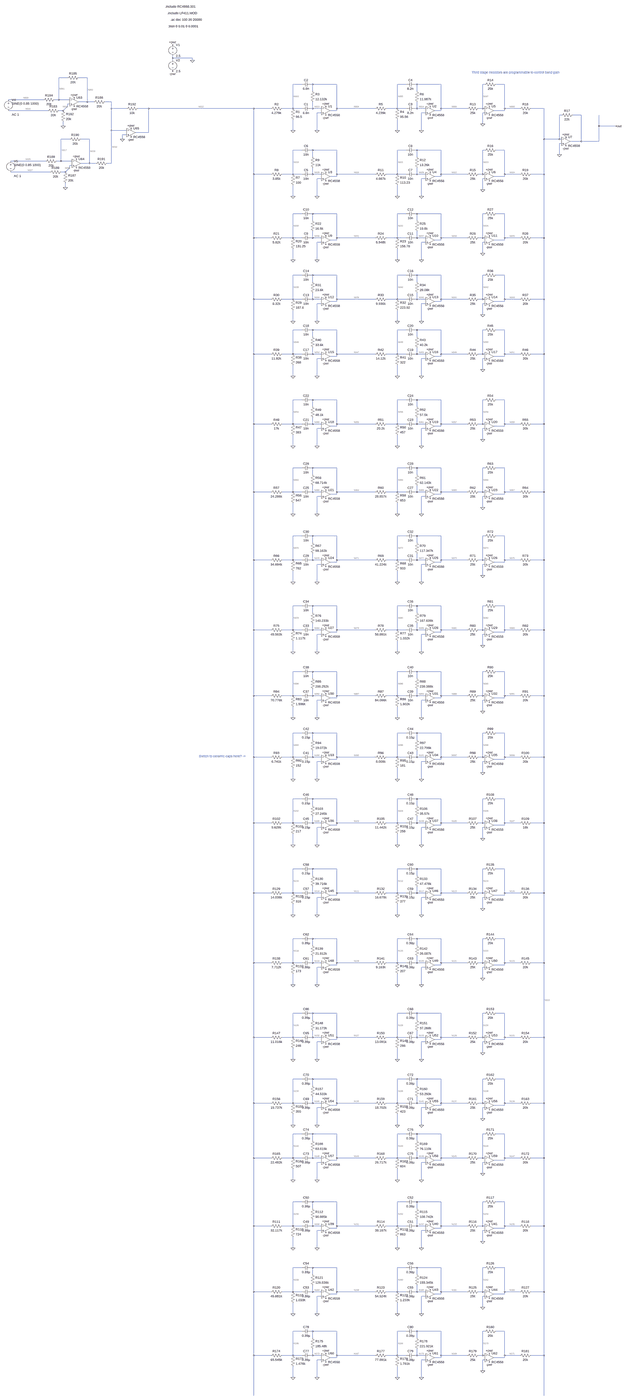
[diagram p0: schematic Equalizer.asc, whole sheet]
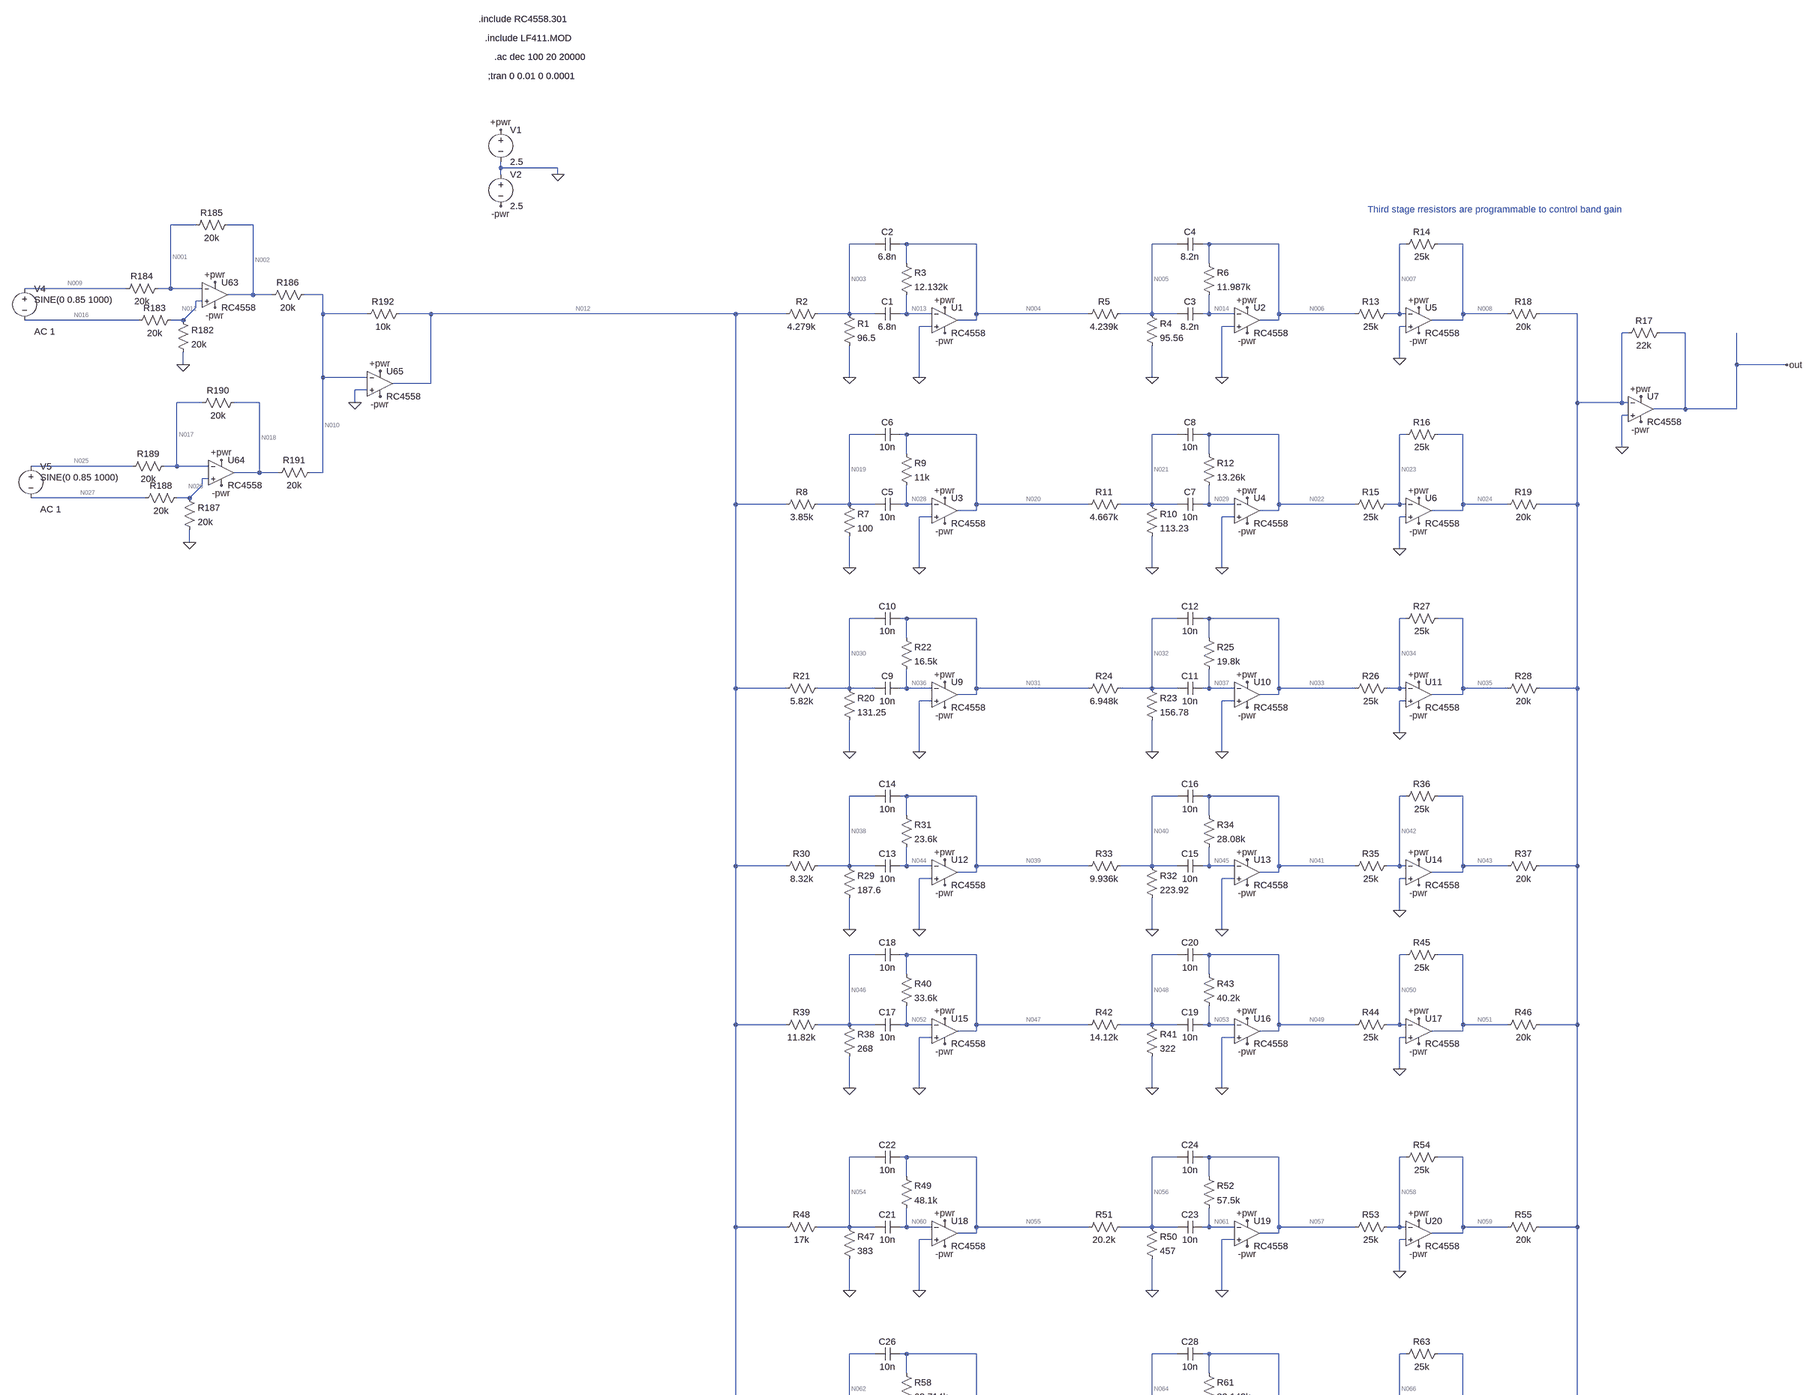
[diagram p1: schematic Equalizer.asc, part, row 1 of 3, column 1 of 1]
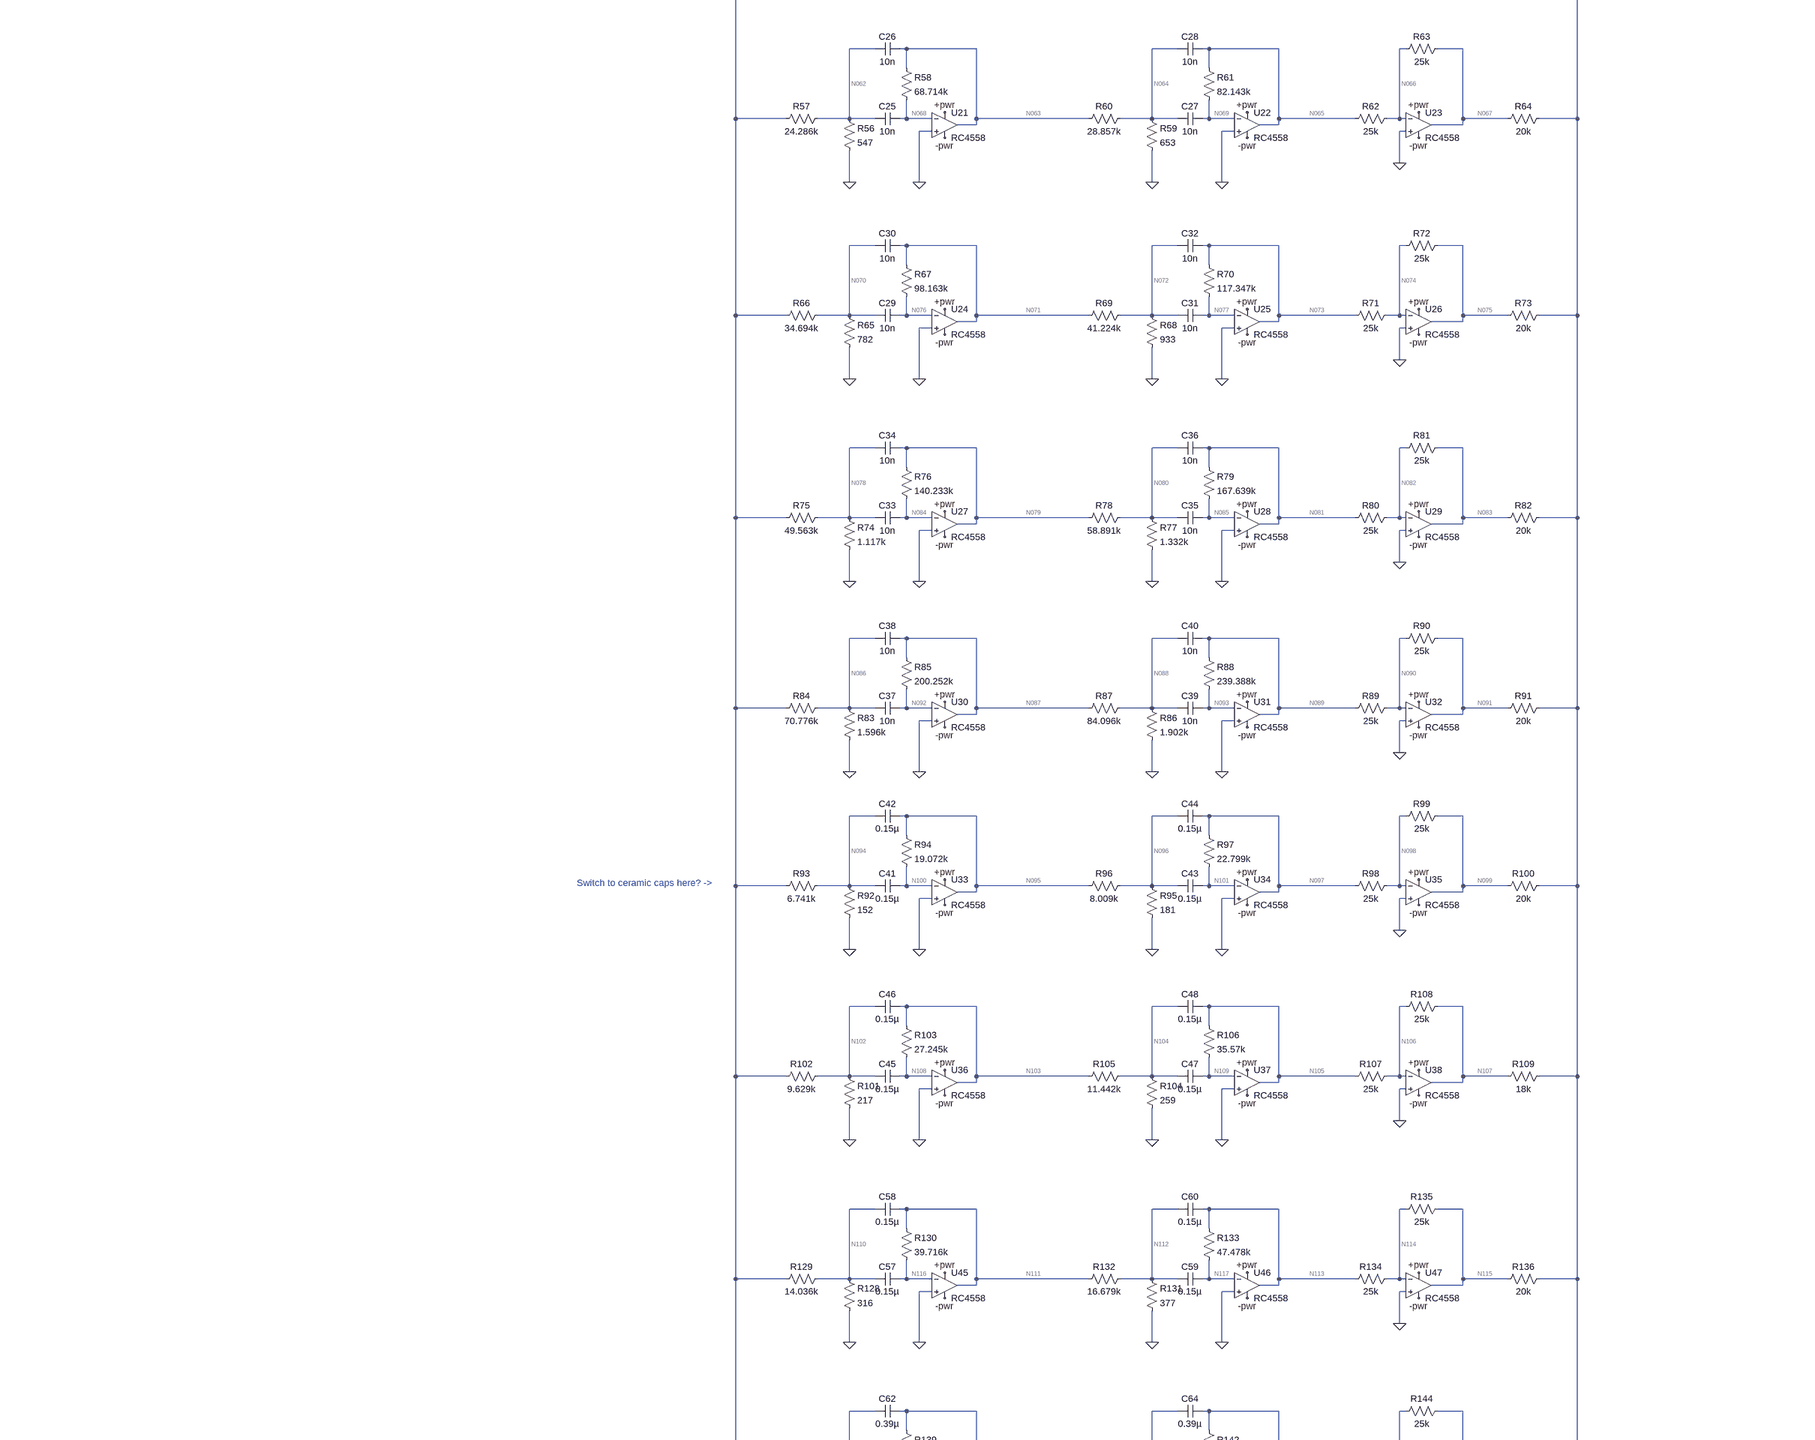
[diagram p2: schematic Equalizer.asc, part, row 2 of 3, column 1 of 1]
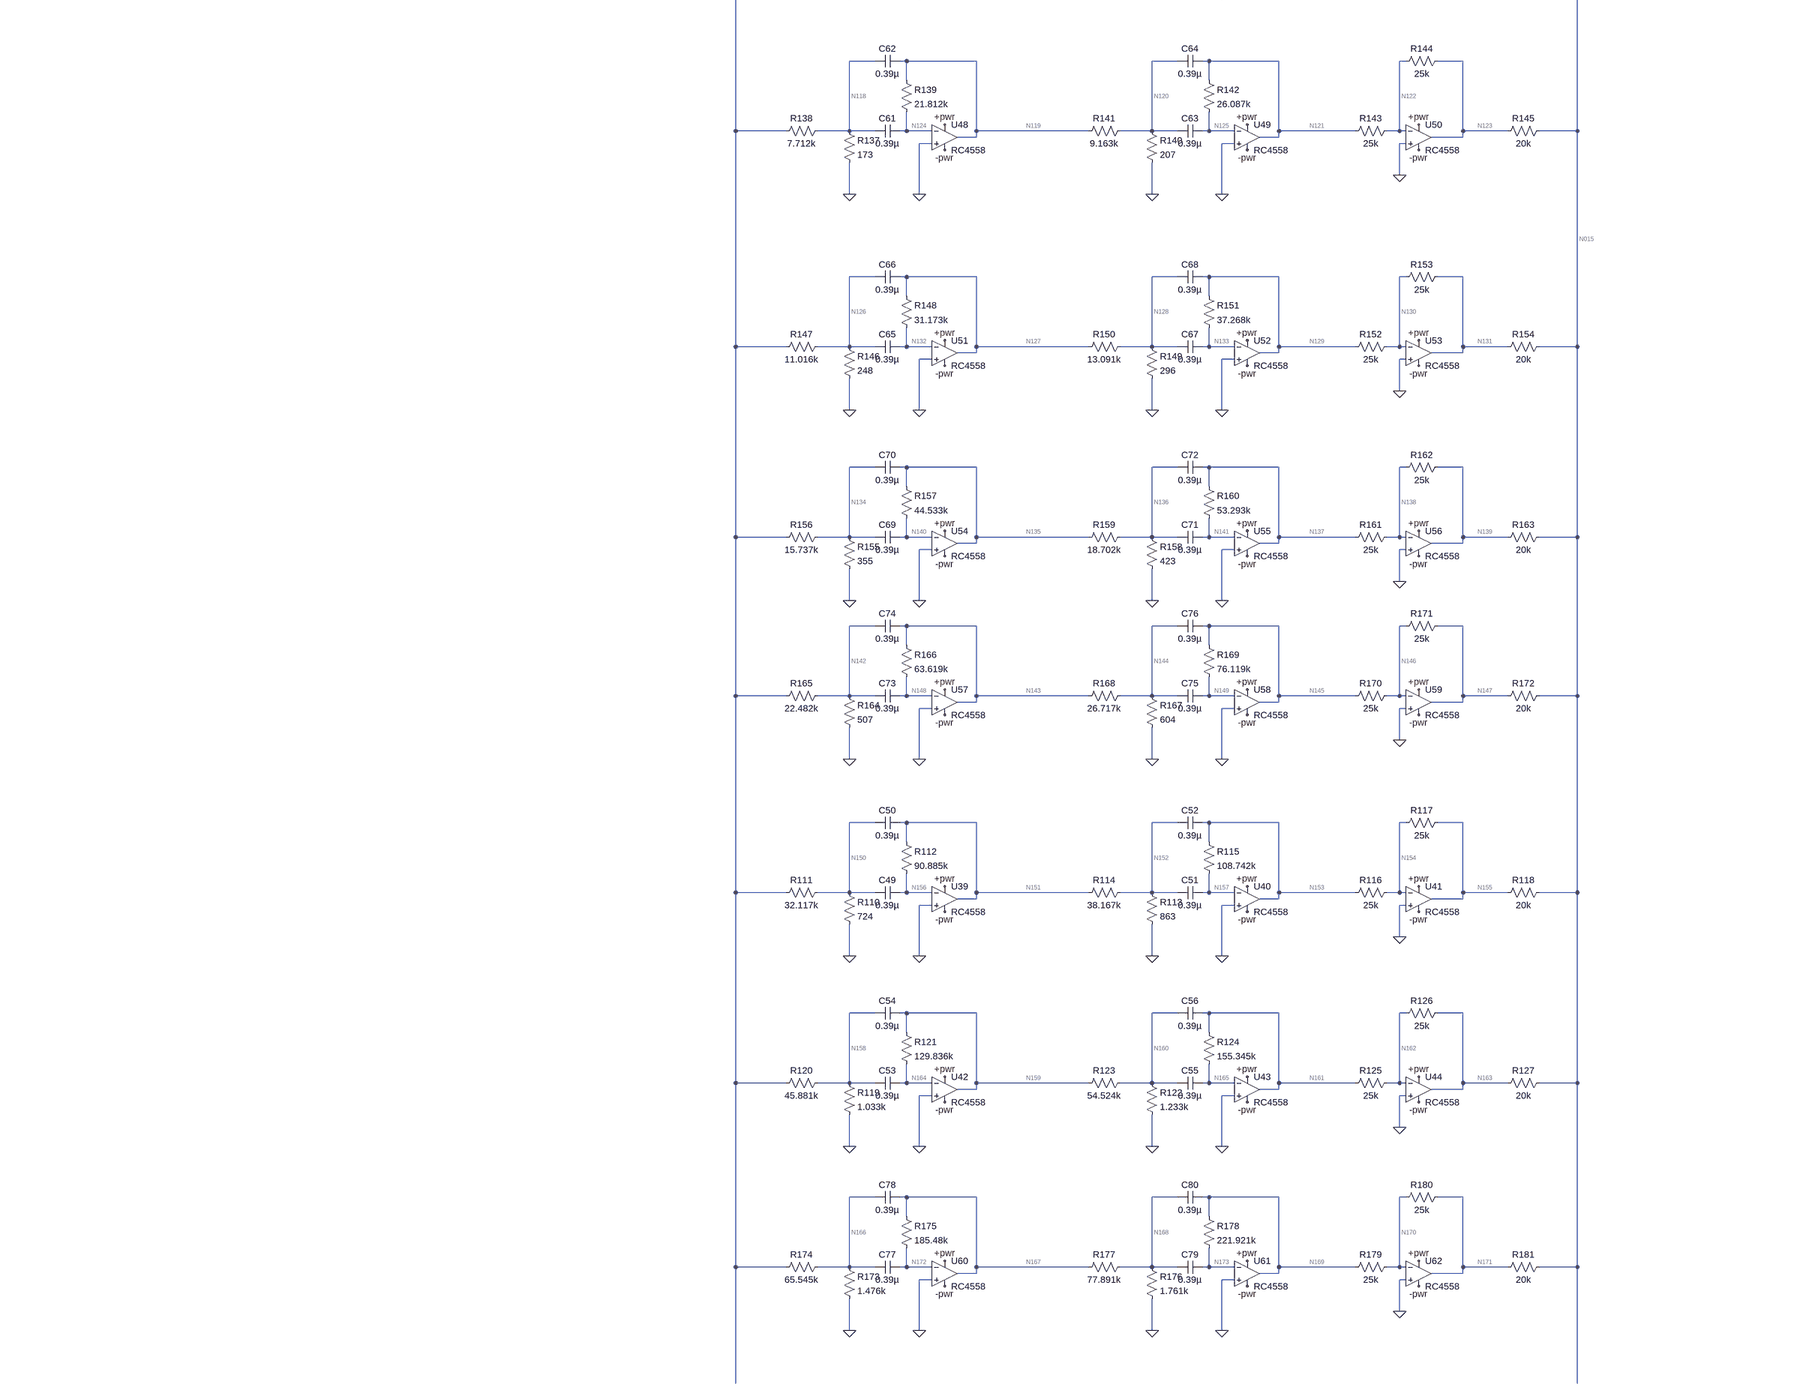
[diagram p3: schematic Equalizer.asc, part, row 3 of 3, column 1 of 1]
* Equalizer.asc
V1 +pwr 0 2.5
V2 0 -pwr 2.5
XU1 0 N013 +pwr -pwr N004 RC4558  ; pins In+ In- V+ V- OUT
R1 N003 0 96.5
R2 N003 N012 4.279k
C1 N013 N003 6.8n
C2 N004 N003 6.8n
R3 N004 N013 12.132k
XU2 0 N014 +pwr -pwr N006 RC4558  ; pins In+ In- V+ V- OUT
R4 N005 0 95.56
R5 N005 N004 4.239k
C3 N014 N005 8.2n
C4 N006 N005 8.2n
R6 N006 N014 11.987k
R13 N007 N006 25k
XU5 0 N007 +pwr -pwr N008 RC4558  ; pins In+ In- V+ V- OUT
R14 N008 N007 25k
XU7 0 N015 +pwr -pwr out RC4558  ; pins In+ In- V+ V- OUT
R17 out N015 22k
R18 N015 N008 20k
XU3 0 N028 +pwr -pwr N020 RC4558  ; pins In+ In- V+ V- OUT
R7 N019 0 100
R8 N019 N012 3.85k
C5 N028 N019 10n
C6 N020 N019 10n
R9 N020 N028 11k
XU4 0 N029 +pwr -pwr N022 RC4558  ; pins In+ In- V+ V- OUT
R10 N021 0 113.23
R11 N021 N020 4.667k
C7 N029 N021 10n
C8 N022 N021 10n
R12 N022 N029 13.26k
R15 N023 N022 25k
XU6 0 N023 +pwr -pwr N024 RC4558  ; pins In+ In- V+ V- OUT
R16 N024 N023 25k
R19 N015 N024 20k
XU9 0 N036 +pwr -pwr N031 RC4558  ; pins In+ In- V+ V- OUT
R20 N030 0 131.25
R21 N030 N012 5.82k
C9 N036 N030 10n
C10 N031 N030 10n
R22 N031 N036 16.5k
XU10 0 N037 +pwr -pwr N033 RC4558  ; pins In+ In- V+ V- OUT
R23 N032 0 156.78
R24 N032 N031 6.948k
C11 N037 N032 10n
C12 N033 N032 10n
R25 N033 N037 19.8k
R26 N034 N033 25k
XU11 0 N034 +pwr -pwr N035 RC4558  ; pins In+ In- V+ V- OUT
R27 N035 N034 25k
R28 N015 N035 20k
XU12 0 N044 +pwr -pwr N039 RC4558  ; pins In+ In- V+ V- OUT
R29 N038 0 187.6
R30 N038 N012 8.32k
C13 N044 N038 10n
C14 N039 N038 10n
R31 N039 N044 23.6k
XU13 0 N045 +pwr -pwr N041 RC4558  ; pins In+ In- V+ V- OUT
R32 N040 0 223.92
R33 N040 N039 9.936k
C15 N045 N040 10n
C16 N041 N040 10n
R34 N041 N045 28.08k
R35 N042 N041 25k
XU14 0 N042 +pwr -pwr N043 RC4558  ; pins In+ In- V+ V- OUT
R36 N043 N042 25k
R37 N015 N043 20k
XU15 0 N052 +pwr -pwr N047 RC4558  ; pins In+ In- V+ V- OUT
R38 N046 0 268
R39 N046 N012 11.82k
C17 N052 N046 10n
C18 N047 N046 10n
R40 N047 N052 33.6k
XU16 0 N053 +pwr -pwr N049 RC4558  ; pins In+ In- V+ V- OUT
R41 N048 0 322
R42 N048 N047 14.12k
C19 N053 N048 10n
C20 N049 N048 10n
R43 N049 N053 40.2k
R44 N050 N049 25k
XU17 0 N050 +pwr -pwr N051 RC4558  ; pins In+ In- V+ V- OUT
R45 N051 N050 25k
R46 N015 N051 20k
XU18 0 N060 +pwr -pwr N055 RC4558  ; pins In+ In- V+ V- OUT
R47 N054 0 383
R48 N054 N012 17k
C21 N060 N054 10n
C22 N055 N054 10n
R49 N055 N060 48.1k
XU19 0 N061 +pwr -pwr N057 RC4558  ; pins In+ In- V+ V- OUT
R50 N056 0 457
R51 N056 N055 20.2k
C23 N061 N056 10n
C24 N057 N056 10n
R52 N057 N061 57.5k
R53 N058 N057 25k
XU20 0 N058 +pwr -pwr N059 RC4558  ; pins In+ In- V+ V- OUT
R54 N059 N058 25k
R55 N015 N059 20k
XU21 0 N068 +pwr -pwr N063 RC4558  ; pins In+ In- V+ V- OUT
R56 N062 0 547
R57 N062 N012 24.286k
C25 N068 N062 10n
C26 N063 N062 10n
R58 N063 N068 68.714k
XU22 0 N069 +pwr -pwr N065 RC4558  ; pins In+ In- V+ V- OUT
R59 N064 0 653
R60 N064 N063 28.857k
C27 N069 N064 10n
C28 N065 N064 10n
R61 N065 N069 82.143k
R62 N066 N065 25k
XU23 0 N066 +pwr -pwr N067 RC4558  ; pins In+ In- V+ V- OUT
R63 N067 N066 25k
R64 N015 N067 20k
XU24 0 N076 +pwr -pwr N071 RC4558  ; pins In+ In- V+ V- OUT
R65 N070 0 782
R66 N070 N012 34.694k
C29 N076 N070 10n
C30 N071 N070 10n
R67 N071 N076 98.163k
XU25 0 N077 +pwr -pwr N073 RC4558  ; pins In+ In- V+ V- OUT
R68 N072 0 933
R69 N072 N071 41.224k
C31 N077 N072 10n
C32 N073 N072 10n
R70 N073 N077 117.347k
R71 N074 N073 25k
XU26 0 N074 +pwr -pwr N075 RC4558  ; pins In+ In- V+ V- OUT
R72 N075 N074 25k
R73 N015 N075 20k
XU27 0 N084 +pwr -pwr N079 RC4558  ; pins In+ In- V+ V- OUT
R74 N078 0 1.117k
R75 N078 N012 49.563k
C33 N084 N078 10n
C34 N079 N078 10n
R76 N079 N084 140.233k
XU28 0 N085 +pwr -pwr N081 RC4558  ; pins In+ In- V+ V- OUT
R77 N080 0 1.332k
R78 N080 N079 58.891k
C35 N085 N080 10n
C36 N081 N080 10n
R79 N081 N085 167.639k
R80 N082 N081 25k
XU29 0 N082 +pwr -pwr N083 RC4558  ; pins In+ In- V+ V- OUT
R81 N083 N082 25k
R82 N015 N083 20k
XU30 0 N092 +pwr -pwr N087 RC4558  ; pins In+ In- V+ V- OUT
R83 N086 0 1.596k
R84 N086 N012 70.776k
C37 N092 N086 10n
C38 N087 N086 10n
R85 N087 N092 200.252k
XU31 0 N093 +pwr -pwr N089 RC4558  ; pins In+ In- V+ V- OUT
R86 N088 0 1.902k
R87 N088 N087 84.096k
C39 N093 N088 10n
C40 N089 N088 10n
R88 N089 N093 239.388k
R89 N090 N089 25k
XU32 0 N090 +pwr -pwr N091 RC4558  ; pins In+ In- V+ V- OUT
R90 N091 N090 25k
R91 N015 N091 20k
XU33 0 N100 +pwr -pwr N095 RC4558  ; pins In+ In- V+ V- OUT
R92 N094 0 152
R93 N094 N012 6.741k
C41 N100 N094 0.15µ
C42 N095 N094 0.15µ
R94 N095 N100 19.072k
XU34 0 N101 +pwr -pwr N097 RC4558  ; pins In+ In- V+ V- OUT
R95 N096 0 181
R96 N096 N095 8.009k
C43 N101 N096 0.15µ
C44 N097 N096 0.15µ
R97 N097 N101 22.799k
R98 N098 N097 25k
XU35 0 N098 +pwr -pwr N099 RC4558  ; pins In+ In- V+ V- OUT
R99 N099 N098 25k
R100 N015 N099 20k
XU36 0 N108 +pwr -pwr N103 RC4558  ; pins In+ In- V+ V- OUT
R101 N102 0 217
R102 N102 N012 9.629k
C45 N108 N102 0.15µ
C46 N103 N102 0.15µ
R103 N103 N108 27.245k
XU37 0 N109 +pwr -pwr N105 RC4558  ; pins In+ In- V+ V- OUT
R104 N104 0 259
R105 N104 N103 11.442k
C47 N109 N104 0.15µ
C48 N105 N104 0.15µ
R106 N105 N109 35.57k
R107 N106 N105 25k
XU38 0 N106 +pwr -pwr N107 RC4558  ; pins In+ In- V+ V- OUT
R108 N107 N106 25k
R109 N015 N107 18k
XU39 0 N156 +pwr -pwr N151 RC4558  ; pins In+ In- V+ V- OUT
R110 N150 0 724
R111 N150 N012 32.117k
C49 N156 N150 0.39µ
C50 N151 N150 0.39µ
R112 N151 N156 90.885k
XU40 0 N157 +pwr -pwr N153 RC4558  ; pins In+ In- V+ V- OUT
R113 N152 0 863
R114 N152 N151 38.167k
C51 N157 N152 0.39µ
C52 N153 N152 0.39µ
R115 N153 N157 108.742k
R116 N154 N153 25k
XU41 0 N154 +pwr -pwr N155 RC4558  ; pins In+ In- V+ V- OUT
R117 N155 N154 25k
R118 N015 N155 20k
XU42 0 N164 +pwr -pwr N159 RC4558  ; pins In+ In- V+ V- OUT
R119 N158 0 1.033k
R120 N158 N012 45.881k
C53 N164 N158 0.39µ
C54 N159 N158 0.39µ
R121 N159 N164 129.836k
XU43 0 N165 +pwr -pwr N161 RC4558  ; pins In+ In- V+ V- OUT
R122 N160 0 1.233k
R123 N160 N159 54.524k
C55 N165 N160 0.39µ
C56 N161 N160 0.39µ
R124 N161 N165 155.345k
R125 N162 N161 25k
XU44 0 N162 +pwr -pwr N163 RC4558  ; pins In+ In- V+ V- OUT
R126 N163 N162 25k
R127 N015 N163 20k
XU45 0 N116 +pwr -pwr N111 RC4558  ; pins In+ In- V+ V- OUT
R128 N110 0 316
R129 N110 N012 14.036k
C57 N116 N110 0.15µ
C58 N111 N110 0.15µ
R130 N111 N116 39.716k
XU46 0 N117 +pwr -pwr N113 RC4558  ; pins In+ In- V+ V- OUT
R131 N112 0 377
R132 N112 N111 16.679k
C59 N117 N112 0.15µ
C60 N113 N112 0.15µ
R133 N113 N117 47.478k
R134 N114 N113 25k
XU47 0 N114 +pwr -pwr N115 RC4558  ; pins In+ In- V+ V- OUT
R135 N115 N114 25k
R136 N015 N115 20k
XU48 0 N124 +pwr -pwr N119 RC4558  ; pins In+ In- V+ V- OUT
R137 N118 0 173
R138 N118 N012 7.712k
C61 N124 N118 0.39µ
C62 N119 N118 0.39µ
R139 N119 N124 21.812k
XU49 0 N125 +pwr -pwr N121 RC4558  ; pins In+ In- V+ V- OUT
R140 N120 0 207
R141 N120 N119 9.163k
C63 N125 N120 0.39µ
C64 N121 N120 0.39µ
R142 N121 N125 26.087k
R143 N122 N121 25k
XU50 0 N122 +pwr -pwr N123 RC4558  ; pins In+ In- V+ V- OUT
R144 N123 N122 25k
R145 N015 N123 20k
XU51 0 N132 +pwr -pwr N127 RC4558  ; pins In+ In- V+ V- OUT
R146 N126 0 248
R147 N126 N012 11.016k
C65 N132 N126 0.39µ
C66 N127 N126 0.39µ
R148 N127 N132 31.173k
XU52 0 N133 +pwr -pwr N129 RC4558  ; pins In+ In- V+ V- OUT
R149 N128 0 296
R150 N128 N127 13.091k
C67 N133 N128 0.39µ
C68 N129 N128 0.39µ
R151 N129 N133 37.268k
R152 N130 N129 25k
XU53 0 N130 +pwr -pwr N131 RC4558  ; pins In+ In- V+ V- OUT
R153 N131 N130 25k
R154 N015 N131 20k
XU54 0 N140 +pwr -pwr N135 RC4558  ; pins In+ In- V+ V- OUT
R155 N134 0 355
R156 N134 N012 15.737k
C69 N140 N134 0.39µ
C70 N135 N134 0.39µ
R157 N135 N140 44.533k
XU55 0 N141 +pwr -pwr N137 RC4558  ; pins In+ In- V+ V- OUT
R158 N136 0 423
R159 N136 N135 18.702k
C71 N141 N136 0.39µ
C72 N137 N136 0.39µ
R160 N137 N141 53.293k
R161 N138 N137 25k
XU56 0 N138 +pwr -pwr N139 RC4558  ; pins In+ In- V+ V- OUT
R162 N139 N138 25k
R163 N015 N139 20k
XU57 0 N148 +pwr -pwr N143 RC4558  ; pins In+ In- V+ V- OUT
R164 N142 0 507
R165 N142 N012 22.482k
C73 N148 N142 0.39µ
C74 N143 N142 0.39µ
R166 N143 N148 63.619k
XU58 0 N149 +pwr -pwr N145 RC4558  ; pins In+ In- V+ V- OUT
R167 N144 0 604
R168 N144 N143 26.717k
C75 N149 N144 0.39µ
C76 N145 N144 0.39µ
R169 N145 N149 76.119k
R170 N146 N145 25k
XU59 0 N146 +pwr -pwr N147 RC4558  ; pins In+ In- V+ V- OUT
R171 N147 N146 25k
R172 N015 N147 20k
XU60 0 N172 +pwr -pwr N167 RC4558  ; pins In+ In- V+ V- OUT
R173 N166 0 1.476k
R174 N166 N012 65.545k
C77 N172 N166 0.39µ
C78 N167 N166 0.39µ
R175 N167 N172 185.48k
XU61 0 N173 +pwr -pwr N169 RC4558  ; pins In+ In- V+ V- OUT
R176 N168 0 1.761k
R177 N168 N167 77.891k
C79 N173 N168 0.39µ
C80 N169 N168 0.39µ
R178 N169 N173 221.921k
R179 N170 N169 25k
XU62 0 N170 +pwr -pwr N171 RC4558  ; pins In+ In- V+ V- OUT
R180 N171 N170 25k
R181 N015 N171 20k
XU63 N011 N001 +pwr -pwr N002 RC4558  ; pins In+ In- V+ V- OUT
XU65 0 N010 +pwr -pwr N012 RC4558  ; pins In+ In- V+ V- OUT
V4 N009 N016 SINE(0 0.85 1000) AC 1
R182 N011 0 20k
R183 N011 N016 20k
R184 N001 N009 20k
R185 N002 N001 20k
R186 N010 N002 20k
XU64 N026 N017 +pwr -pwr N018 RC4558  ; pins In+ In- V+ V- OUT
V5 N025 N027 SINE(0 0.85 1000) AC 1
R187 N026 0 20k
R188 N026 N027 20k
R189 N017 N025 20k
R190 N018 N017 20k
R191 N010 N018 20k
R192 N012 N010 10k
.include LF411.MOD
.ac dec 100 20 20000
.include RC4558.301
* Switch to ceramic caps here? ->
* Third stage rresistors are programmable to control band gain
;tran 0 0.01 0 0.0001
.backanno
.end

* Results of the author's LTspice run, read from the files saved beside the schematic
* Operating Point, zero values left out:
*   V(+pwr) = 2.5 V
*   V(-pwr) = -2.5 V
*   V(n004) = -1.704 mV
*   V(n013) = -10.19 µV
*   V(n003) = -30.77 µV
*   V(n012) = -1.395 mV
*   V(n006) = -1.684 mV
*   V(n014) = -10.19 µV
*   V(n005) = -37.56 µV
*   V(n007) = -10.19 µV
*   V(n008) = -1.827 mV
*   V(out) = -166.3 mV
*   V(n015) = -9.632 µV
*   V(n020) = -1.546 mV
*   V(n028) = -10.19 µV
*   V(n019) = -35.32 µV
*   V(n022) = -1.861 mV
*   V(n029) = -10.19 µV
*   V(n021) = -36.62 µV
*   V(n023) = -10.19 µV
*   V(n024) = -1.649 mV
*   V(n031) = -2.314 mV
*   V(n036) = -10.19 µV
*   V(n030) = -30.77 µV
*   V(n033) = -2.774 mV
*   V(n037) = -10.18 µV
*   V(n032) = -51.05 µV
*   V(n034) = -10.19 µV
*   V(n035) = -736.1 µV
*   V(n039) = -3.305 mV
*   V(n044) = -10.18 µV
*   V(n038) = -30.77 µV
*   V(n041) = -3.93 mV
*   V(n045) = -10.18 µV
*   V(n040) = -72.84 µV
*   V(n042) = -10.19 µV
*   V(n043) = 419.8 µV
*   V(n047) = -4.701 mV
*   V(n052) = -10.18 µV
*   V(n046) = -30.93 µV
*   V(n049) = -5.622 mV
*   V(n053) = -10.18 µV
*   V(n048) = -104.8 µV
*   V(n050) = -10.2 µV
*   V(n051) = 2.112 mV
*   V(n055) = -6.725 mV
*   V(n060) = -10.17 µV
*   V(n054) = -30.74 µV
*   V(n057) = -8.037 mV
*   V(n061) = -10.17 µV
*   V(n056) = -148.8 µV
*   V(n058) = -10.21 µV
*   V(n059) = 4.527 mV
*   V(n063) = -9.603 mV
*   V(n068) = -10.16 µV
*   V(n062) = -30.73 µV
*   V(n065) = -11.48 mV
*   V(n069) = -10.16 µV
*   V(n064) = -212.5 µV
*   V(n066) = -10.22 µV
*   V(n067) = 7.967 mV
*   V(n071) = -13.71 mV
*   V(n076) = -10.15 µV
*   V(n070) = -30.76 µV
*   V(n073) = -16.39 mV
*   V(n077) = -10.14 µV
*   V(n072) = -303.5 µV
*   V(n074) = -10.23 µV
*   V(n075) = 12.88 mV
*   V(n079) = -19.59 mV
*   V(n084) = -10.13 µV
*   V(n078) = -30.75 µV
*   V(n081) = -23.41 mV
*   V(n085) = -10.12 µV
*   V(n080) = -433.2 µV
*   V(n082) = -10.25 µV
*   V(n083) = 19.9 mV
*   V(n087) = -27.97 mV
*   V(n092) = -10.11 µV
*   V(n086) = -30.77 µV
*   V(n089) = -33.43 mV
*   V(n093) = -10.09 µV
*   V(n088) = -618.5 µV
*   V(n090) = -10.29 µV
*   V(n091) = 29.92 mV
*   V(n095) = -2.673 mV
*   V(n100) = -10.18 µV
*   V(n094) = -30.77 µV
*   V(n097) = -3.193 mV
*   V(n101) = -10.18 µV
*   V(n096) = -59.07 µV
*   V(n098) = -10.19 µV
*   V(n099) = -317.5 µV
*   V(n103) = -3.814 mV
*   V(n108) = -10.18 µV
*   V(n102) = -30.75 µV
*   V(n105) = -4.976 mV
*   V(n109) = -10.18 µV
*   V(n104) = -84.41 µV
*   V(n106) = -10.2 µV
*   V(n107) = 1.465 mV
*   V(n151) = -12.7 mV
*   V(n156) = -10.15 µV
*   V(n150) = -30.76 µV
*   V(n153) = -15.19 mV
*   V(n157) = -10.15 µV
*   V(n152) = -280.8 µV
*   V(n154) = -10.23 µV
*   V(n155) = 11.68 mV
*   V(n159) = -18.14 mV
*   V(n164) = -10.14 µV
*   V(n158) = -30.72 µV
*   V(n161) = -21.7 mV
*   V(n165) = -10.13 µV
*   V(n160) = -401 µV
*   V(n162) = -10.25 µV
*   V(n163) = 18.19 mV
*   V(n111) = -5.555 mV
*   V(n116) = -10.18 µV
*   V(n110) = -30.72 µV
*   V(n113) = -6.638 mV
*   V(n117) = -10.17 µV
*   V(n112) = -122.8 µV
*   V(n114) = -10.2 µV
*   V(n115) = 3.128 mV
*   V(n119) = -3.055 mV
*   V(n124) = -10.18 µV
*   V(n118) = -30.61 µV
*   V(n121) = -3.652 mV
*   V(n125) = -10.18 µV
*   V(n120) = -67.49 µV
*   V(n122) = -10.19 µV
*   V(n123) = 141.5 µV
*   V(n127) = -4.362 mV
*   V(n132) = -10.18 µV
*   V(n126) = -30.72 µV
*   V(n129) = -5.213 mV
*   V(n133) = -10.18 µV
*   V(n128) = -96.45 µV
*   V(n130) = -10.2 µV
*   V(n131) = 1.702 mV
*   V(n135) = -6.227 mV
*   V(n140) = -10.17 µV
*   V(n134) = -30.78 µV
*   V(n137) = -7.45 mV
*   V(n141) = -10.17 µV
*   V(n136) = -137.7 µV
*   V(n138) = -10.21 µV
*   V(n139) = 3.94 mV
*   V(n143) = -8.892 mV
*   V(n148) = -10.17 µV
*   V(n142) = -30.77 µV
*   V(n145) = -10.64 mV
*   V(n149) = -10.16 µV
*   V(n144) = -196.6 µV
*   V(n146) = -10.22 µV
*   V(n147) = 7.126 mV
*   V(n167) = -25.9 mV
*   V(n172) = -10.11 µV
*   V(n166) = -30.73 µV
*   V(n169) = -30.99 mV
*   V(n173) = -10.1 µV
*   V(n168) = -572.7 µV
*   V(n170) = -10.28 µV
*   V(n171) = 27.48 mV
*   V(n002) = -21.11 µV
*   V(n001) = 2.776 mV
*   V(n011) = 2.786 mV
*   V(n010) = -10.19 µV
*   V(n009) = 2.781 mV
*   V(n016) = 2.781 mV
*   V(n018) = -21.11 µV
*   V(n017) = 2.776 mV
*   V(n026) = 2.786 mV
*   V(n025) = 2.781 mV
*   V(n027) = 2.781 mV
*   I(R192) = -138.5 nA
*   I(R191) = 546.2 pA
*   I(R190) = -139.9 nA
*   I(R189) = -256 pA
*   I(R188) = 256 pA
*   I(R187) = 139.3 nA
*   I(R186) = 546.2 pA
*   I(R185) = -139.9 nA
*   I(R184) = -256 pA
*   I(R183) = 256 pA
*   I(R182) = 139.3 nA
*   I(R181) = -1.374 µA
*   I(R180) = 1.1 µA
*   I(R179) = 1.239 µA
*   I(R178) = -139.6 nA
*   I(R177) = 325.2 nA
*   I(R176) = -325.2 nA
*   I(R175) = -139.6 nA
*   I(R174) = 20.82 nA
*   I(R173) = -20.82 nA
*   I(R172) = -356.8 nA
*   I(R171) = 285.5 nA
*   I(R170) = 425.1 nA
*   I(R169) = -139.6 nA
*   I(R168) = 325.4 nA
*   I(R167) = -325.4 nA
*   I(R166) = -139.6 nA
*   I(R165) = 60.69 nA
*   I(R164) = -60.69 nA
*   I(R163) = -197.5 nA
*   I(R162) = 158 nA
*   I(R161) = 297.6 nA
*   I(R160) = -139.6 nA
*   I(R159) = 325.6 nA
*   I(R158) = -325.6 nA
*   I(R157) = -139.6 nA
*   I(R156) = 86.71 nA
*   I(R155) = -86.71 nA
*   I(R154) = -85.6 nA
*   I(R153) = 68.5 nA
*   I(R152) = 208.1 nA
*   I(R151) = -139.6 nA
*   I(R150) = 325.8 nA
*   I(R149) = -325.8 nA
*   I(R148) = -139.6 nA
*   I(R147) = 123.9 nA
*   I(R146) = -123.9 nA
*   I(R145) = -7.559 nA
*   I(R144) = 6.069 nA
*   I(R143) = 145.7 nA
*   I(R142) = -139.6 nA
*   I(R141) = 326.1 nA
*   I(R140) = -326.1 nA
*   I(R139) = -139.6 nA
*   I(R138) = 177 nA
*   I(R137) = -177 nA
*   I(R136) = -156.9 nA
*   I(R135) = 125.5 nA
*   I(R134) = 265.1 nA
*   I(R133) = -139.6 nA
*   I(R132) = 325.7 nA
*   I(R131) = -325.7 nA
*   I(R130) = -139.6 nA
*   I(R129) = 97.22 nA
*   I(R128) = -97.22 nA
*   I(R127) = -909.8 nA
*   I(R126) = 727.9 nA
*   I(R125) = 867.5 nA
*   I(R124) = -139.6 nA
*   I(R123) = 325.3 nA
*   I(R122) = -325.3 nA
*   I(R121) = -139.6 nA
*   I(R120) = 29.74 nA
*   I(R119) = -29.74 nA
*   I(R118) = -584.5 nA
*   I(R117) = 467.6 nA
*   I(R116) = 607.2 nA
*   I(R115) = -139.6 nA
*   I(R114) = 325.3 nA
*   I(R113) = -325.3 nA
*   I(R112) = -139.6 nA
*   I(R111) = 42.49 nA
*   I(R110) = -42.49 nA
*   I(R109) = -81.95 nA
*   I(R108) = 59.02 nA
*   I(R107) = 198.6 nA
*   I(R106) = -139.6 nA
*   I(R105) = 325.9 nA
*   I(R104) = -325.9 nA
*   I(R103) = -139.6 nA
*   I(R102) = 141.7 nA
*   I(R101) = -141.7 nA
*   I(R100) = 15.39 nA
*   I(R99) = -12.29 nA
*   I(R98) = 127.3 nA
*   I(R97) = -139.6 nA
*   I(R96) = 326.3 nA
*   I(R95) = -326.3 nA
*   I(R94) = -139.6 nA
*   I(R93) = 202.4 nA
*   I(R92) = -202.4 nA
*   I(R91) = -1.496 µA
*   I(R90) = 1.197 µA
*   I(R89) = 1.337 µA
*   I(R88) = -139.6 nA
*   I(R87) = 325.2 nA
*   I(R86) = -325.2 nA
*   I(R85) = -139.6 nA
*   I(R84) = 19.28 nA
*   I(R83) = -19.28 nA
*   I(R82) = -995.6 nA
*   I(R81) = 796.5 nA
*   I(R80) = 936.1 nA
*   I(R79) = -139.6 nA
*   I(R78) = 325.2 nA
*   I(R77) = -325.2 nA
*   I(R76) = -139.6 nA
*   I(R75) = 27.53 nA
*   I(R74) = -27.53 nA
*   I(R73) = -644.6 nA
*   I(R72) = 515.7 nA
*   I(R71) = 655.3 nA
*   I(R70) = -139.6 nA
*   I(R69) = 325.3 nA
*   I(R68) = -325.3 nA
*   I(R67) = -139.6 nA
*   I(R66) = 39.33 nA
*   I(R65) = -39.33 nA
*   I(R64) = -398.8 nA
*   I(R63) = 319.1 nA
*   I(R62) = 458.7 nA
*   I(R61) = -139.6 nA
*   I(R60) = 325.4 nA
*   I(R59) = -325.4 nA
*   I(R58) = -139.6 nA
*   I(R57) = 56.19 nA
*   I(R56) = -56.19 nA
*   I(R55) = -226.8 nA
*   I(R54) = 181.5 nA
*   I(R53) = 321.1 nA
*   I(R52) = -139.6 nA
*   I(R51) = 325.6 nA
*   I(R50) = -325.6 nA
*   I(R49) = -139.6 nA
*   I(R48) = 80.27 nA
*   I(R47) = -80.27 nA
*   I(R46) = -106.1 nA
*   I(R45) = 84.88 nA
*   I(R44) = 224.5 nA
*   I(R43) = -139.6 nA
*   I(R42) = 325.5 nA
*   I(R41) = -325.5 nA
*   I(R40) = -139.6 nA
*   I(R39) = 115.4 nA
*   I(R38) = -115.4 nA
*   I(R37) = -21.47 nA
*   I(R36) = 17.2 nA
*   I(R35) = 156.8 nA
*   I(R34) = -139.6 nA
*   I(R33) = 325.3 nA
*   I(R32) = -325.3 nA
*   I(R31) = -139.6 nA
*   I(R30) = 164 nA
*   I(R29) = -164 nA
*   I(R28) = 36.32 nA
*   I(R27) = -29.04 nA
*   I(R26) = 110.6 nA
*   I(R25) = -139.6 nA
*   I(R24) = 325.6 nA
*   I(R23) = -325.6 nA
*   I(R22) = -139.6 nA
*   I(R21) = 234.5 nA
*   I(R20) = -234.5 nA
*   I(R19) = 81.97 nA
*   I(R16) = -65.56 nA
*   I(R15) = 74.05 nA
*   I(R12) = -139.6 nA
*   I(R11) = 323.4 nA
*   I(R10) = -323.4 nA
*   I(R9) = -139.6 nA
*   I(R8) = 353.2 nA
*   I(R7) = -353.2 nA
*   I(R18) = 90.86 nA
*   I(R17) = -7.56 µA
*   I(R14) = -72.67 nA
*   I(R13) = 66.94 nA
*   I(R6) = -139.6 nA
*   I(R5) = 393.1 nA
*   I(R4) = -393.1 nA
*   I(R3) = -139.6 nA
*   I(R2) = 318.9 nA
*   I(R1) = -318.9 nA
*   I(V5) = -256 pA
*   I(V4) = -256 pA
*   I(V2) = -15.14 mA
*   I(V1) = -15.17 mA
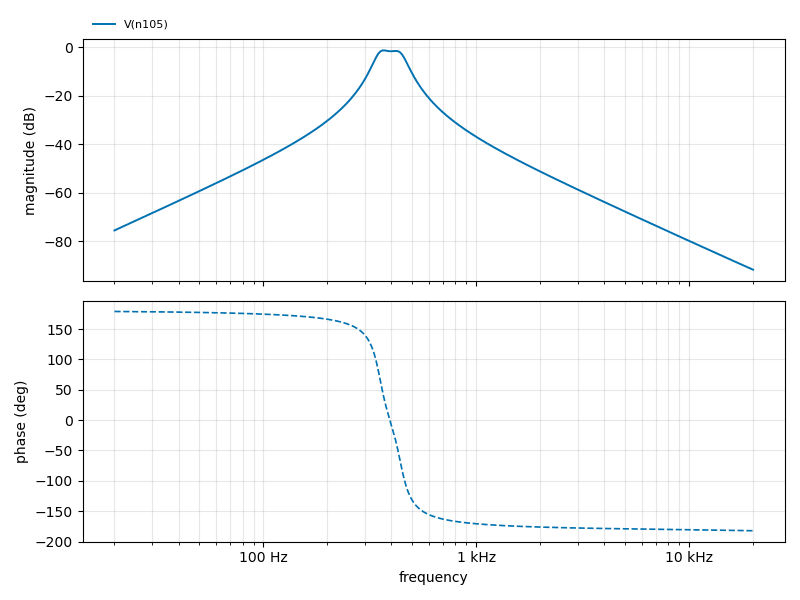
[diagram p4: AC Analysis of Equalizer.asc, plotted from the saved traces]
* AC Analysis, 1 run:
*   V(n105): -75.45 dB at 20 Hz, -91.63 dB at 20 kHz, peak -1.29 dB at 363.9 Hz, 3 dB below the peak at 338.2 Hz and 458.8 Hz